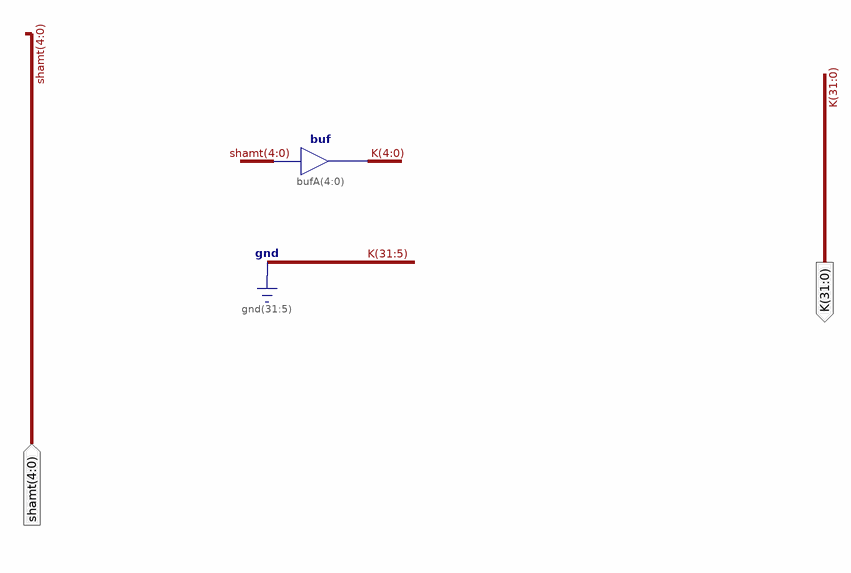
[diagram p0: schematic sheet 1]
// Xilinx ISE schematic expansion5.sch (artix7) as structural Verilog: 1 symbols, 2 ports
module expansion5 (
  input  [4:0] shamt,
  output [31:0] K
);

  assign K[4:0] = shamt;  // buf bufA[4..0], 5 bits wide

  assign K[31:5] = {27{1'b0}};
endmodule
